# Altium schematic sheet MPPT.SchDoc
size A3; SheetNumber: 1; SheetTotal: 1
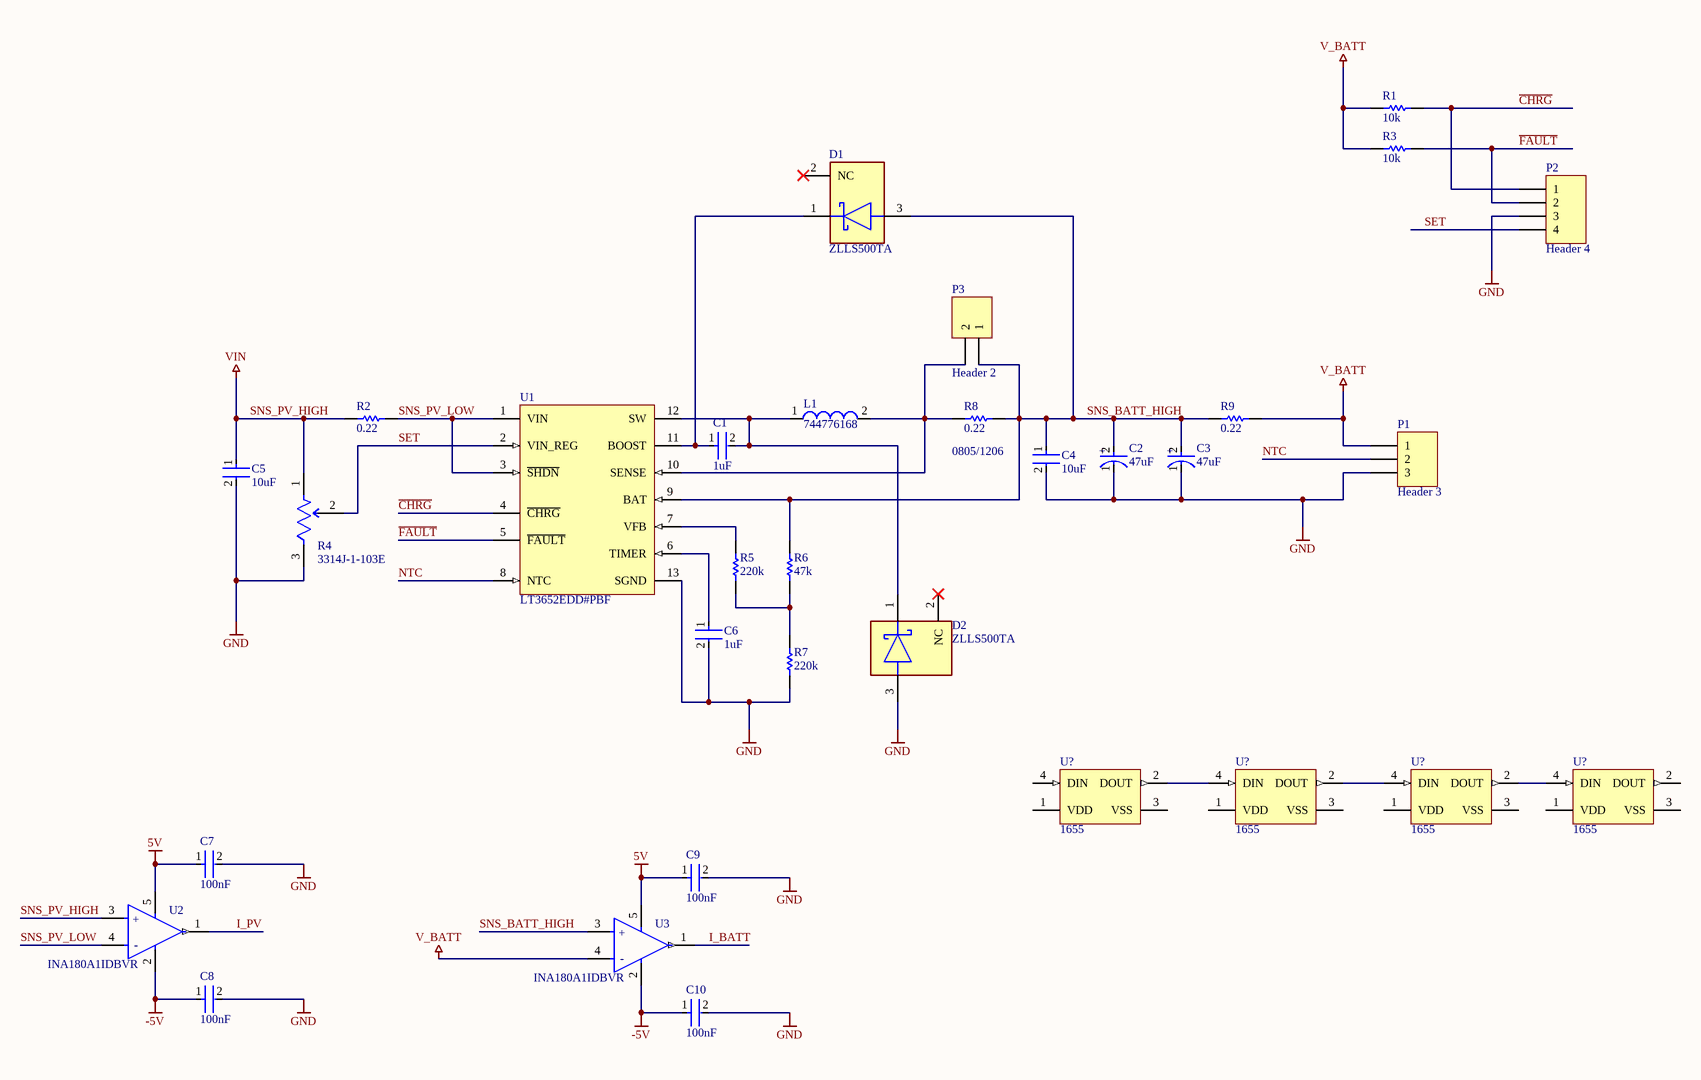
[diagram p0: MPPT.SchDoc]

## Parts
(Parts that share a designator on the sheet are numbered #1, #2 ... from top to bottom, then left to right.)
C1  1uF  [FP-0603-L_1_6_0_15-W_0_8-IPC_C]
C2  47uF  [FP-T491A476M006AT-MFG]
C3  47uF  [FP-T491A476M006AT-MFG]
C4  10uF  [FP-0603-L_1_6_0_15-W_0_8-MFG]
C5  10uF  [FP-0603-L_1_6_0_15-W_0_8-MFG]
C6  1uF  [FP-0603-L_1_6_0_15-W_0_8-IPC_C]
C7  100nF  [FP-CGA3E-0_3-0_1-IPC_A]
C8  100nF  [FP-CGA3E-0_3-0_1-IPC_A]
C9  100nF  [FP-CGA3E-0_3-0_1-IPC_A]
C10  100nF  [FP-CGA3E-0_3-0_1-IPC_A]
D1  ZLLS500TA  [FP-SOT23-IPC_B]
D2  ZLLS500TA  [FP-SOT23-IPC_B]
L1  744776168  [WE-PD2-XL]
P1  Header 3  [HDR1X3]
P2  Header 4  [HDR1X4]
P3  Header 2  [HDR1X2]
R1  10k  [RESC1609X55X30LL15T15]
R2  0.22  [RESC2013X70X40NL20T20]
R3  10k  [RESC1609X55X30LL15T15]
R4  3314J-1-103E  [FP-3314J-1-MFG]
R5  220k  [RESC1608X55X25ML10T15]
R6  47k  [RESC1608X55X30NL15T15]
R7  220k  [RESC1608X55X25ML10T15]
R8  0.22  [RESC2013X70X40NL20T20]
R9  0.22  [RESC2013X70X40NL20T20]
U1  LT3652EDD#PBF  [LT-DD-12_V]
U2  INA180A1IDBVR  [FP-DBV0005A-IPC_A]
U3  INA180A1IDBVR  [FP-DBV0005A-IPC_A]
U?#1  1655  [ADA-RGB-1655_V]
U?#2  1655  [ADA-RGB-1655_V]
U?#3  1655  [ADA-RGB-1655_V]
U?#4  1655  [ADA-RGB-1655_V]

## Nets
5V: C7.1 C9.1 U2.5(VS) U3.5(VS)
-5V: C8.1 C10.1 U2.2(GND) U3.2(GND)
GND: C2.1(C) C3.1(C) C4.2 C5.2 C6.2 C7.2 C8.2 C9.2 C10.2 D2.3(A) P1.3 P2.3 R4.3(CW) R7.1 U1.13(SGND)
SNS_PV_HIGH: C5.1 R2.1 R4.1(CCW) U2.3(IN+)  [also labelled VIN]
V_BATT: P1.1 R1.1 R3.1 R9.2 U3.4(IN-)
~{CHRG}: P2.1 R1.2 U1.4(~{CHRG})
~{FAULT}: P2.2 R3.2 U1.5(~{FAULT})
I_BATT: U3.1(OUT)
I_PV: U2.1(OUT)
NTC: P1.2 U1.8(NTC)
SET: P2.4 R4.2(WIPER) U1.2(VIN_REG)
SNS_BATT_HIGH: C2.2(A) C3.2(A) C4.1 D1.3(A) P3.1 R6.2 R8.2 R9.1 U1.9(BAT) U3.3(IN+)
SNS_PV_LOW: R2.2 U1.1(VIN) U1.3(~{SHDN}) U2.4(IN-)
NetC1_1: C1.1 D1.1(C) U1.11(BOOST)
NetC1_2: C1.2 D2.1(C) L1.1 U1.12(SW)
NetC6_1: C6.1 U1.6(TIMER)
NetL1_2: L1.2 P3.2 R8.1 U1.10(SENSE)
NetR5_1: R5.1 R6.1 R7.2
NetR5_2: R5.2 U1.7(VFB)
NetU?#1_2: U?#1.2(DOUT) U?#2.4(DIN)
NetU?#2_2: U?#2.2(DOUT) U?#3.4(DIN)
NetU?#3_2: U?#3.2(DOUT) U?#4.4(DIN)

Not connected (* = marked no-connect by the designer): D1 2(NC)*; D2 2(NC)*; U?#1 1(VDD) 3(VSS) 4(DIN); U?#2 1(VDD) 3(VSS); U?#3 1(VDD) 3(VSS); U?#4 1(VDD) 2(DOUT) 3(VSS)

## Notes on the sheet
- 0805/1206
- (in symbol CMP-2000-07189-2) +
- (in symbol CMP-04895-000140-1) +; -

## Library data of the parts
C1 C6 = CMP-2000-07531-4: Ceramic Capacitor General Use 1uF ±10% 50V X7R 0603; Series: M; Width: 0.031inch; Mount: Surface Mount; Radiation Hardening: No; Voltage Rating (DC): 50V; Packaging: Tape and Reel; Termination: SMD/SMT; Depth: 0.8mm; Case Code (Metric): 1608; Case Code (Imperial): 0603; Height: 0.8mm; Voltage Rating: 50V; Package Quantity: 1; Halogen Free: Halogen Free; Dielectric: X7R; Min Operating Temperature: -55°C; Length: 1.6mm; Construction: Flat; Tolerance: 10%; Thickness: 0.037inch; Max Operating Temperature: 125°C; Case/Package: 0603; Capacitance: 1uF; RoHS Compliant: Yes
C2 C3 = CMP-2000-07189-2: CAP TANT 47UF 20% 6.3V 1206; Voltage Rating (DC): 6V; ESR (Equivalent Series Resistance): 3.5R; Ripple Current: 146mA; Dissipation Factor: 12%; Dielectric Material: Tantalum; Life (Hours): 2000Hour; Leakage Current: 3uA; Polarity: Polar; Height - Seated (Max): 0.071inch; Case Code (Metric): 3216; Depth: 1.6mm; Case/Package: 1206; Termination: SMD/SMT; Number of Pins: 2; Max Operating Temperature: 125°C; Lead Free: Lead Free; Package Quantity: 1; Radiation Hardening: No; REACH SVHC: No SVHC; Features: General Purpose; Voltage: 6.3V; Width: 1.6mm; Mount: Surface Mount; Voltage Rating: 6.3V; Construction: Flat; Capacitance: 47uF; Height: 1.6mm; Tolerance: 20%; Series: T491; Length: 3.2mm; RoHS Compliant: Yes; Packaging: Tape and Reel; Case Code (Imperial): 1206; Min Operating Temperature: -55°C
C4 C5 = CMP-14477-000812-2: None; Tolerance: 20%; Voltage: 6.3V; Dielectric: X5R; Height: 0.8mm; Capacitance: 10uF; Depth: 0.8mm; Max Operating Temperature: 85°C; Packaging: Tape and Reel; Length: 1.6mm; Voltage Rating: 6.3V; Mount: Surface Mount; Case/Package: 0603; Termination: Wraparound; Min Operating Temperature: -55°C; Width: 0.031inch; RoHS Compliant: Yes; Thickness: 0.037inch
C7-C10 = CMP-2000-07546-2: Cap Ceramic 100nF 50V X7R 10% Pad SMD 0603 +125°C Automotive T/R; Weight: 7.1E-05oz; Composition: Ceramic; Max Operating Temperature: 125°C; Termination: SMD/SMT; Dielectric: X7R; Length: 1.6mm; Package Quantity: 1; REACH SVHC: No SVHC; Lead Free: Lead Free; Case Code (Metric): 1608; Min Operating Temperature: -55°C; Packaging: Tape and Reel; Tolerance: 10%; Voltage Rating: 50V; Case Code (Imperial): 0603; Capacitance: 100nF; Case/Package: 0603; Voltage Rating (DC): 50V; Depth: 0.8mm; Radiation Hardening: No; Ratings: AEC-Q200; Mount: Surface Mount; Voltage: 50V; Thickness: 0.035inch; Width: 0.8mm; Height: 0.8mm
D1 D2 = CMP-12790-000060-1: DIODE SCHOTTKY 40V 700MA SOT23-3; Max Forward Surge Current (Ifsm): 3.2A; Polarity: Standard; Peak Reverse Current: 10uA; Forward Voltage: 800mV; Peak Non-Repetitive Surge Current: 13A; Capacitance: 16pF; Power Dissipation: 500mW; Element Configuration: Single; Reverse Recovery Time: 3ns; Max Reverse Voltage (DC): 40V; Min Operating Temperature: -55°C; Height: 1mm; Termination: SMD/SMT; Forward Current: 700mA; Current Rating: 700mA; Max Operating Temperature: 150°C; Case/Package: SOT-23; Output Current: 700mA; Lead Free: Lead Free; Radiation Hardening: No; Mount: Surface Mount; Weight: 0.000282oz; Package Quantity: 3000; Width: 1.4mm; Packaging: Tape and Reel; Length: 3.05mm; Average Rectified Current: 700mA; Number of Pins: 3; Max Repetitive Reverse Voltage (Vrrm): 40V; Voltage Rating (DC): 40V
L1 = CMP-0227-00489-1: SMD Power Inductor WE-PD2, L = 68.0 µH; Inductance: 68.0 ÂµH; ComponentLink1URL: http://www.we-online.com; ComponentLink2Description: Datasheet; ComponentLink2URL: http://www.we-online.de/katalog/media/pdf/744776168.pdf; PackageVersion: 2004; DatasheetVersion: ver 1, Oct-2004; ComponentLink1Description: Manufacturer Link; PackageDescription: SMD Inductor, 2-Leads, Body 10.0 x 9.0 mm; PackageReference: WE-PD2-XL
P1 = Header 3: Header, 3-Pin; LatestRevisionDate: 17-Jul-2002; LatestRevisionNote: Re-released for DXP Platform.; Publisher: Altium Limited
P2 = Header 4: Header, 4-Pin; LatestRevisionDate: 17-Jul-2002; LatestRevisionNote: Re-released for DXP Platform.; Publisher: Altium Limited
P3 = Header 2: Header, 2-Pin; LatestRevisionDate: 17-Jul-2002; LatestRevisionNote: Re-released for DXP Platform.; Publisher: Altium Limited
R1 R3 = CMP-1012-00623-3: Chip Resistor, 10 KOhm, +/- 1%, 0.1 W, -55 to 155 degC, 0603 (1608 Metric), RoHS, Tape and Reel; Manufacturer: Panasonic; Voltage Rating: 75V; Case\/Package: 0603; Power Rating: 100mW; Resistance: 10KOhm; Temperature Coefficient: 100ppm\/degreesC; Number of Pins: 2; Package Reference: 603; Depth: 0.8mm; Mount: SurfaceMount; Package Description: 2-Pin Surface Mount Device, Body 1.6 x 0.85 mm; Datasheet Version: 02/2017; Length: 1.6mm; Lead Free: LeadFree; Height: 0.45mm; Number of Terminations: 2; Max Power Dissipation: 100mW; Min Operating Temperature: -55degC; Datasheet URL: https://industrial.panasonic.com/cdbs/www-data/pdf/RDA0000/AOA0000C304.pdf; Termination: SMD/SMT; Case Code (Metric): 1608; Case Code (Imperial): 0603; Tolerance: 1%; Max Operating Temperature: 155degC; RoHSCompliant: true; Voltage Rating (DC): 75V; Radiation Hardening: No; Packaging: TapeandReel; Composition: ThickFilm; Mounting Technology: SurfaceMount; Manufacturer URL: http://www.panasonic.com/; Width: 0.031inch; REACH SVHC: NoSVHC; Contact Plating: Tin; Military Standard: Not; Package Quantity: 1
R2 R8 R9 = CMP-2001-00466-1: Manufacturer: Panasonic; Part Number: ERJ6RQFR22V
R4 = CMP-07234-000035-1: TRIMMER 10K OHM 0.25W J LEAD TOP; RoHS Compliant: Yes
R5 R7 = CMP-1659-00037-1: Chip Resistor, 220 KOhm, +/- 1%, 100 mW, -55 to 155 degC, 0603 (1608 Metric), RoHS, Tape and Reel; Resistance: 0.1 Ohm; ComponentLink1Description: Manufacturer URL; ComponentLink2Description: Datasheet; ComponentLink1URL: http://www.yageo.com/; REACH SVHC: No SVHC; RoHSCompliant: true; DatasheetVersion: Rev. 4, 02/2016; Min Operating Temperature: -25 degC; Height: 0.25 inch; ComponentLink2URL: http://www.yageo.com/documents/recent/PYu-RC_Group_51_RoHS_L_04.pdf; PackageDescription: 2-Pin Surface Mount Device, Body 1.6 x 0.8 mm; Max Operating Temperature: 70 degC; Width: 0.25 inch; Length: 0.75 inch; PackageReference: 0603
R6 = CMP-2000-00523-2: Chip Resistor, 47 KOhm, +/- 1%, 0.1 W, -55 to 155 degC, 0603 (1608 Metric), RoHS, Tape and Reel; Case\Package: 0603; Forward Current: 20 mA; Power Rating: 90 mW; Illumination Colour: Red; Nominal Vf: 2.1 V; Viewing Angle: 160 degrees; Luminous Intensity: 63 mcd; Lens Style: Clear; Nominal Wavelength: 639 nm; Case Code (Imperial): 0603; Case Code (Metric): 1608; Packaging: Tape and Reel; Radiation Hardening: No; Colour: Red; PackageDescription: 2-Pin Surface Mount Device, Body 1.6 x 0.85 mm; ComponentLink1Description: Manufacturer URL; Width: 0.8 mm; DatasheetVersion: Apr-15; ComponentLink2URL: http://industrial.panasonic.com/cdbs/www-data/pdf/RDA0000/AOA0000C86.pdf; Min Operating Temperature: -40 degC; Height: 0.6 mm; Package Quantity: 3000; ComponentLink2Description: Datasheet; REACH SVHC: No SVHC; ComponentLink1URL: http://www.panasonic.com/; Mount: Surface Mount; RoHSCompliant: true; Max Operating Temperature: 100 degC; PackageReference: 0603; Length: 1.6 mm; Forward Voltage: 2.1 V; Pins: 2
U1 = CMP-0473-00061-1: Power Tracking 2 A Battery Charger for Solar Power, 12-pin SON (DD-12), -40 to 125 degC, Pb-Free; Manufacturer: Linear Technology; Vin Max(V): 32; Vin Min(V): 4.95; Number of Outputs: 1; PartNumber: LT3652EDD#PBF; ComponentLink3Description: Package Specification; Mounting Technology: Surface Mount; ComponentLink1Description: Manufacturer URL; Topology: Battery Charger; ComponentLink2Description: Datasheet; PackageDescription: 12-Pin Plastic DFN, Body 3 x 3 mm, Pitch 0.45 mm; ComponentLink1URL: http://www.linear.com/; PackageVersion: Rev. A, 06/2010; PackageReference: DD-12; ComponentLink3URL: http://cds.linear.com/docs/en/packaging/DFN_12_05-08-1725.pdf; DatasheetVersion: Rev. D; Energy Source: Solar; ComponentLink2URL: http://cds.linear.com/docs/en/datasheet/3652fd.pdf; RoHS: TRUE
U2 U3 = CMP-04895-000140-1: IC CURR SENSE 1 CIRCUIT SOT23-5; Input Bias Current: 100nA; Input Offset Voltage (Vos): 100uV; Number of Circuits: 1; Slew Rate: 2V/µs; -3db Bandwidth: 350kHz; Operating Supply Current: 260uA; Case/Package: SOT-23-5; Min Operating Temperature: -40°C; Mount: Surface Mount; Packaging: Tape and Reel; Max Operating Temperature: 125°C
U?#1-U?#4 = CMP-2000-05026-1: Intelligent Control LED Integrated Light Source, 3.5 to 5.3 V, -25 to 80 degC, 4-Pin SMD, RoHS, Tape and Reel; Manufacturer: Adafruit-Industries-LLC; Number of LEDs: 10; Configuration: Discrete; Utilized LED: WS2812(5050); Datasheet URL: http://datasheet.octopart.com/ADA1655-Adafruit-Industries-datasheet-32028139.pdf; Series: Neopixel; Interface: -; Package Description: 4-Pin Surface Mount Device, Body 5 x 5 mm; Color: Red,Green,Blue(RGB); Category: Optoelectronics; Controller Type: -; Package Reference: 1655; Manufacturer URL: https://www.adafruit.com/; Mounting Type: SurfaceMount; Datasheet Version: May-13; Size / Dimension: 5.00mmLx5.00mmW; Family: Addressable,Specialty